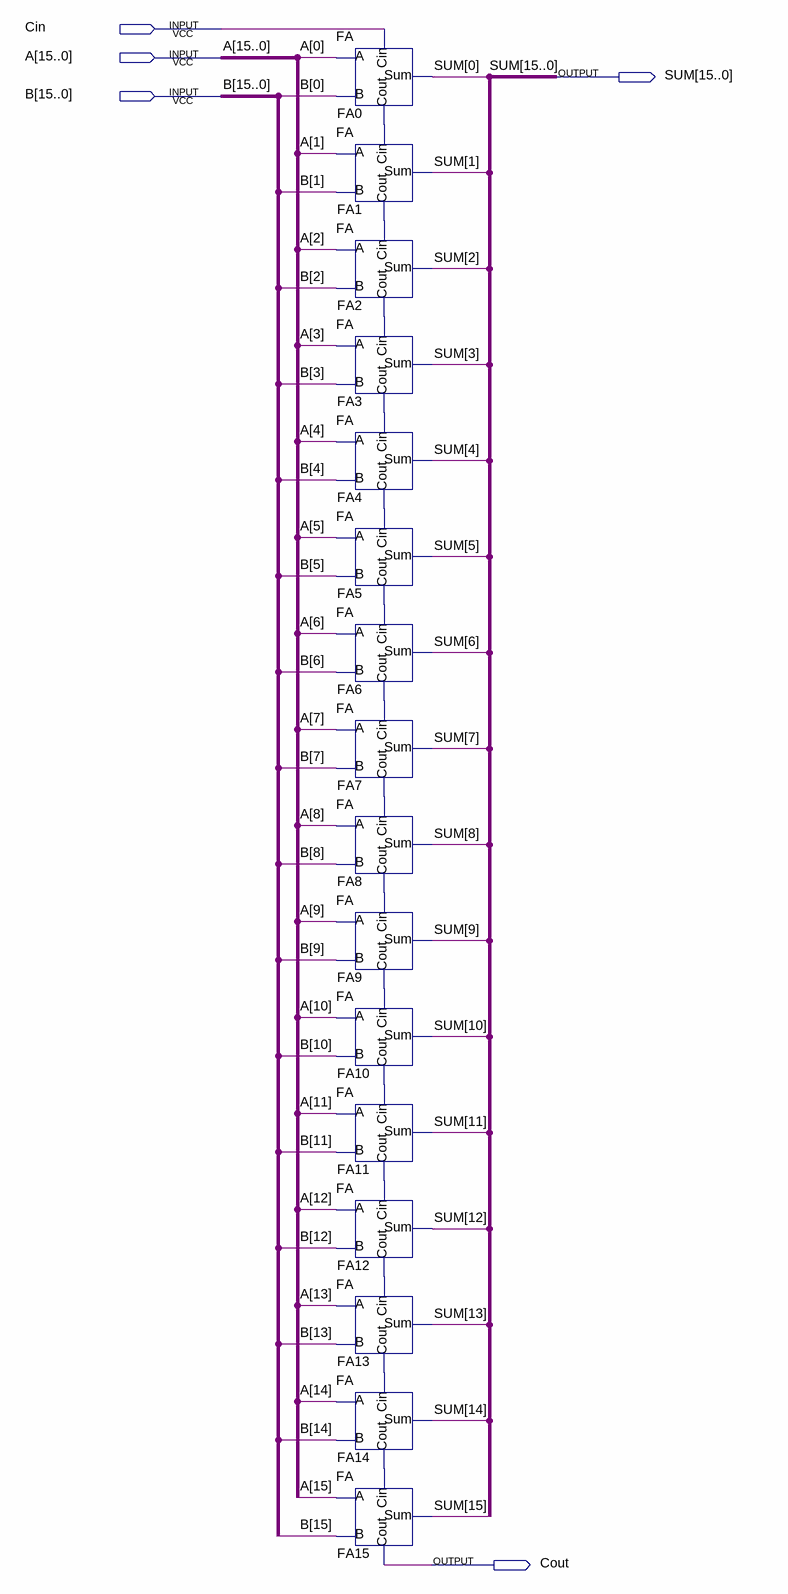
[diagram p0: schematic sheet]
// Quartus schematic FA_16.bdf as structural Verilog: 16 symbols, 5 pins
module FA_16 (
  input  Cin,
  input  [15:0] A,
  input  [15:0] B,
  output [15:0] SUM,
  output Cout
);

  wire FA0_cout, FA1_cout, FA2_cout, FA3_cout, FA4_cout, FA5_cout, FA6_cout, FA7_cout, FA8_cout, FA9_cout,
       FA10_cout, FA11_cout, FA12_cout, FA13_cout, FA14_cout;

  FA FA0 (.A(A[0]), .B(B[0]), .Cin(Cin), .Sum(SUM[0]), .Cout(FA0_cout));
  FA FA1 (.A(A[1]), .B(B[1]), .Cin(FA0_cout), .Sum(SUM[1]), .Cout(FA1_cout));
  FA FA2 (.A(A[2]), .B(B[2]), .Cin(FA1_cout), .Sum(SUM[2]), .Cout(FA2_cout));
  FA FA3 (.A(A[3]), .B(B[3]), .Cin(FA2_cout), .Sum(SUM[3]), .Cout(FA3_cout));
  FA FA4 (.A(A[4]), .B(B[4]), .Cin(FA3_cout), .Sum(SUM[4]), .Cout(FA4_cout));
  FA FA5 (.A(A[5]), .B(B[5]), .Cin(FA4_cout), .Sum(SUM[5]), .Cout(FA5_cout));
  FA FA6 (.A(A[6]), .B(B[6]), .Cin(FA5_cout), .Sum(SUM[6]), .Cout(FA6_cout));
  FA FA7 (.A(A[7]), .B(B[7]), .Cin(FA6_cout), .Sum(SUM[7]), .Cout(FA7_cout));
  FA FA8 (.A(A[8]), .B(B[8]), .Cin(FA7_cout), .Sum(SUM[8]), .Cout(FA8_cout));
  FA FA9 (.A(A[9]), .B(B[9]), .Cin(FA8_cout), .Sum(SUM[9]), .Cout(FA9_cout));
  FA FA10 (.A(A[10]), .B(B[10]), .Cin(FA9_cout), .Sum(SUM[10]), .Cout(FA10_cout));
  FA FA11 (.A(A[11]), .B(B[11]), .Cin(FA10_cout), .Sum(SUM[11]), .Cout(FA11_cout));
  FA FA12 (.A(A[12]), .B(B[12]), .Cin(FA11_cout), .Sum(SUM[12]), .Cout(FA12_cout));
  FA FA13 (.A(A[13]), .B(B[13]), .Cin(FA12_cout), .Sum(SUM[13]), .Cout(FA13_cout));
  FA FA14 (.A(A[14]), .B(B[14]), .Cin(FA13_cout), .Sum(SUM[14]), .Cout(FA14_cout));
  FA FA15 (.A(A[15]), .B(B[15]), .Cin(FA14_cout), .Sum(SUM[15]), .Cout(Cout));
endmodule
